# Altium schematic sheet motorOut.SchDoc
size A4
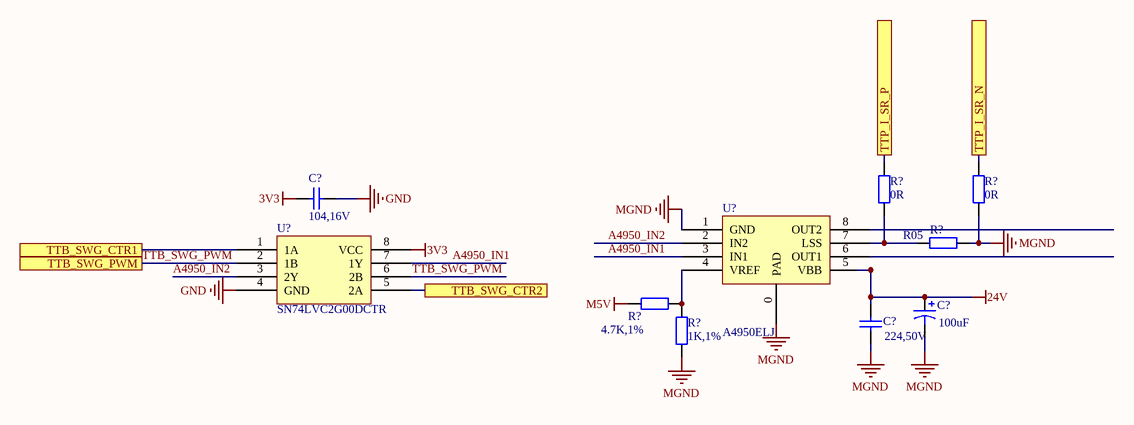
[diagram p0: motorOut.SchDoc]

## Parts
(Parts that share a designator on the sheet are numbered #1, #2 ... from top to bottom, then left to right.)
C?#1  104,16V  [C0805 - 1]
C?#2  value 100uF  [CAP-6.3MM]  (hidden comment: 100uF,25V,直插铝电解电容)
C?#3  224,50V  [C0805 - 1]
R?#1  value 0R  [LC-2512]  (hidden comment: R05, 采样电阻)
R?#2  value 0R  [LC-2512]  (hidden comment: R05, 采样电阻)
R?#3  value R05  [LC-2512]  (hidden comment: R05, 采样电阻)
R?#4  4.7K,1%  [R0805]
R?#5  1K,1%  [R0805]
U?#1  A4950ELJ  [SOICN8]
U?#2  SN74LVC2G00DCTR  [SM8]

## Ports
TTB_SWG_CTR1, TTB_SWG_CTR2, TTB_SWG_PWM, TTP_I_SR_N, TTP_I_SR_P

## Nets
3V3: C?#1.1 U?#2.8(VCC)
24V: C?#2.1 C?#3.2 U?#1.5(VBB)
GND: C?#1.2 U?#2.4(GND)
M5V: R?#4.2
MGND: C?#2.2 C?#3.1 R?#2.2 R?#3.1 R?#5.2 U?#1.0(PAD) U?#1.1(GND)
A4950_IN1: U?#1.3(IN1) U?#2.7(1Y)
A4950_IN2: U?#1.2(IN2) U?#2.3(2Y)
TTB_SWG_CTR1: U?#2.1(1A) ; port TTB_SWG_CTR1
TTB_SWG_CTR2: U?#2.5(2A) ; port TTB_SWG_CTR2
TTB_SWG_PWM: U?#2.2(1B) U?#2.6(2B) ; port TTB_SWG_PWM
TTP_I_SR_N: R?#2.1 ; port TTP_I_SR_N
TTP_I_SR_P: R?#1.1 ; port TTP_I_SR_P
NetR?#1_2: R?#1.2 R?#3.2 U?#1.7(LSS)
NetR?#4_1: R?#4.1 R?#5.1 U?#1.4(VREF)

Not connected (* = marked no-connect by the designer): U?#1 6(OUT1) 8(OUT2)

## Library data of the parts
C?#1 = 无极电容: Type: 贴片电容; Value: 104, 16V
C?#2 = Cap Pol1: Polarized Capacitor (Radial); Published: 8-Jun-2000; LatestRevisionDate: 17-Jul-2002; LatestRevisionNote: Re-released for DXP Platform.; PackageReference: RB7.6-15; Publisher: Altium Limited; PackageDescription: Polarized Capacitor (Radial); 2 Leads
C?#3 = Cap: Capacitor; Published: 8-Jun-2000; LatestRevisionDate: 17-Jul-2002; LatestRevisionNote: Re-released for DXP Platform.; PackageReference: RAD-0.3; Publisher: Altium Limited; PackageDescription: Radial Cap, Thru-Hole; 2 Leads; 0.3 in Pin Spacing; Value: 224,50V
R?#1-R?#5 = Res2: Resistor; Published: 8-Jun-2000; LatestRevisionDate: 17-Jul-2002; LatestRevisionNote: Re-released for DXP Platform.; PackageReference: AXIAL-0.4; Publisher: Altium Limited; PackageDescription: Axial Device, Thru-Hole; 2 Leads; 0.4 in Pin Spacing
U?#1 = A4950: 电机驱动，单个全桥
U?#2 = SN74LVC2G08: Dual 2 input NAND